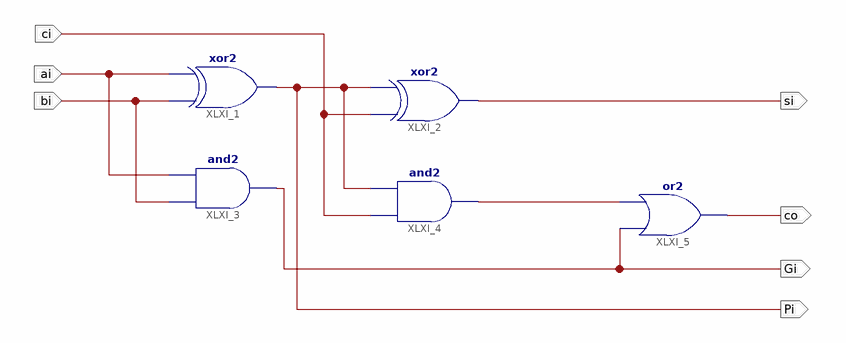
[diagram p0: schematic sheet 1]
// Xilinx ISE schematic add.sch (kintex7) as structural Verilog: 5 symbols, 7 ports
module add (
  input  ai,
  input  bi,
  input  ci,
  output Pi,
  output Gi,
  output co,
  output si
);

  wire XLXN_14;

  xor XLXI_1 (Pi, bi, ai);
  xor XLXI_2 (si, ci, Pi);
  and XLXI_3 (Gi, bi, ai);
  and XLXI_4 (XLXN_14, ci, Pi);
  or XLXI_5 (co, Gi, XLXN_14);
endmodule
